# Altium project brake_light_ethan_second_tut.PrjPcb
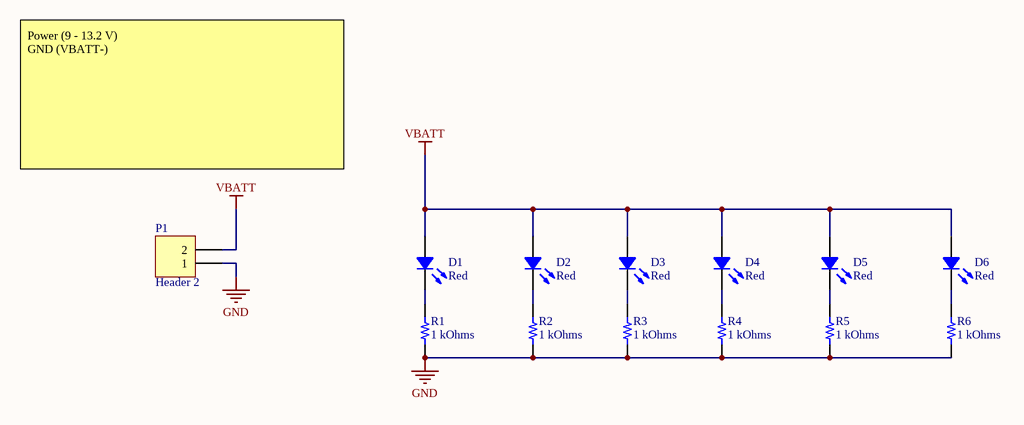
[diagram p0: TOP.SchDoc]
1 sheet, 13 parts. Net scope: global (net labels, ports and power ports of the same name join across sheets).
Board file: PCB.PcbDoc

## Sheet TOP.SchDoc: =DocumentName
size A4; Organization: Queen's Formula SAE; Address1: 130 Stuart St, Kingston; Address2: Ontario; Address3: Canada; Address4: K7L 2V9; DocumentNumber: 1; Revision: 0; SheetNumber: 1; SheetTotal: 1

### Parts
D1  Red  [LED 1206_3216 RED]
D2  Red  [LED 1206_3216 RED]
D3  Red  [LED 1206_3216 RED]
D4  Red  [LED 1206_3216 RED]
D5  Red  [LED 1206_3216 RED]
D6  Red  [LED 1206_3216 RED]
P1  Header 2  [HDR1X2]
R1  1 kOhms  [RES 0402_1005]
R2  1 kOhms  [RES 0402_1005]
R3  1 kOhms  [RES 0402_1005]
R4  1 kOhms  [RES 0402_1005]
R5  1 kOhms  [RES 0402_1005]
R6  1 kOhms  [RES 0402_1005]

### Nets
GND: P1.1 R1.1 R2.1 R3.1 R4.1 R5.1 R6.1
VBATT: D1.1 D2.1 D3.1 D4.1 D5.1 D6.1 P1.2
NetD1_2: D1.2 R1.2
NetD2_2: D2.2 R2.2
NetD3_2: D3.2 R3.2
NetD4_2: D4.2 R4.2
NetD5_2: D5.2 R5.2
NetD6_2: D6.2 R6.2

### Notes on the sheet
- Power (9 - 13.2 V)
  GND (VBATT-)
- Title
- Size:
- Date:
- A4
- Number:
- Time:
- Revision:
- Sheet
- of
- File:

### Library data of the parts
D1-D6 = APTR3216SECK/J3-PRV: LED SMD; Manufacturer: Kingbright; Configuration: 1206; Current - Test: 20mA; Lens Color: Colorless; Lens Size: 1.60mm x 1.40mm; Lens Style: Rectangle with Flat Top; Lens Transparency: Clear; Millicandela Rating: 350mcd; Viewing Angle: 140°; Voltage - Forward (Vf) (Typ): 2.2V; Wavelength - Dominant: 625nm; Wavelength - Peak: 640nm; Part Number: APTR3216SECK/J3-PRV; Color: Red; ComponentLink1Description: Datasheet; ComponentLink1URL: http://www.kingbrightusa.com/images/catalog/SPEC/APTR3216SECK-J3-PRV.pdf; ComponentLink2Description: DigiKey Link; ComponentLink2URL: https://www.digikey.com/en/products/detail/kingbright/APTR3216SECK-J3-PRV/10293085; Device Package: 1206 (3216 Metric); Height (Max): 1.25mm; LastUpdated: 2022-09-19 1:50:50 PM; Lifecycle Status: Active; Minimum Order: 1; Mounting Type: Surface Mount; Package / Case: 1206 (3216 Metric); Packaging: TapeAndReel; PartId: 194; Part Status: Active; Price: 0.17; Series: Heli-R; Size / Dimension: 3.20mm L x 1.60mm W; Supplier 1: DigiKey; Supplier Part Number 1: 754-APTR3216SECK/J3-PRVCT-ND; Supplier Device Package: 1206; Value: Red
P1 = Header 2: Header, 2-Pin; LatestRevisionDate: 17-Jul-2002; LatestRevisionNote: Re-released for DXP Platform.; Publisher: Altium Limited
R1-R6 = AT0402BRD071KL: RES SMD 1K OHM 0.1% 1/16W 0402; Manufacturer: Yageo; Power (Watts): 0.063W, 1/16W; Temperature Coefficient: ±25ppm/°C; Part Number: AT0402BRD071KL; Value: 1 kOhms; ComponentLink1Description: Datasheet; ComponentLink1URL: http://www.yageo.com/documents/recent/PYu-AT_51_RoHS_L_5.pdf; ComponentLink2Description: DigiKey Link; ComponentLink2URL: https://www.digikey.com/en/products/detail/yageo/AT0402BRD071KL/5138607; Composition: Thin Film; Device Package: 0402 (1005 Metric); Features: Anti-Sulfur, Automotive AEC-Q200, Moisture Resistant; Height - Seated (Max): 0.014" (0.35mm); LastUpdated: 2022-09-19 1:15:04 PM; Lifecycle Status: Active; Minimum Order: 1; Number of Terminations: 2; Operating Temperature: -55°C ~ 155°C; Package / Case: 0402 (1005 Metric); Packaging: TapeAndReel; PartId: 2462; Part Status: Active; Price: 0.09; Ratings: AEC-Q200; Resistance: 1 kOhms; Series: AT; Size / Dimension: 0.039" L x 0.020" W (1.00mm x 0.50mm); Supplier 1: DigiKey; Supplier Part Number 1: YAG2088CT-ND; Supplier Device Package: 0402; Tolerance: ±0.1%